# Altium project BowieGlove.PrjPcb
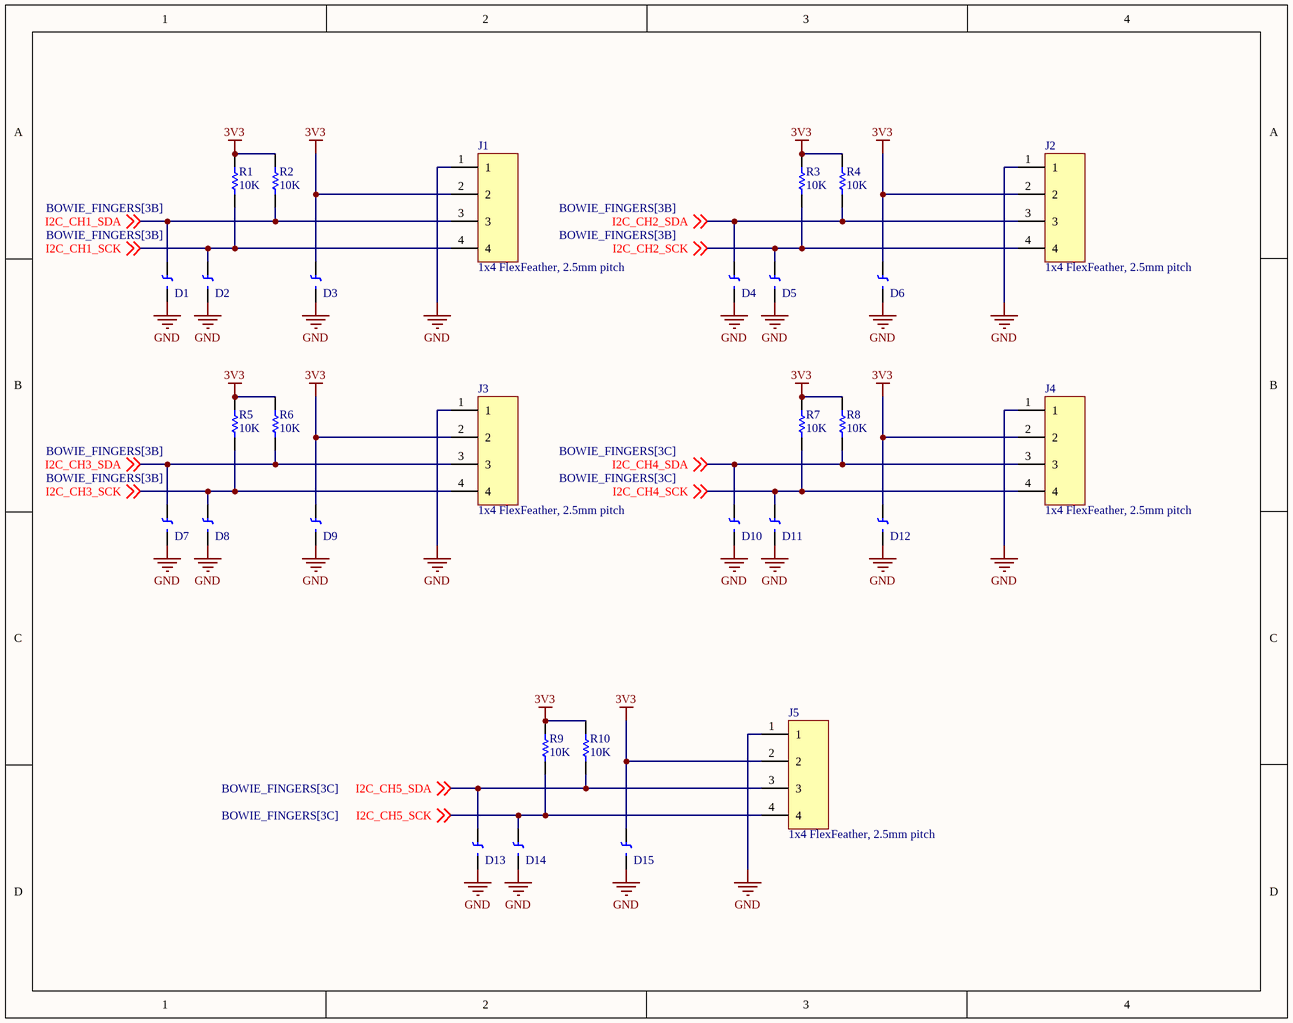
[diagram p0: BOWIE_CONNECTORS.SchDoc]
8 sheets, 103 parts. Net scope: global (net labels, ports and power ports of the same name join across sheets).
Board file: BowieGlove.PcbDoc
Sheets:
  BOWIE_CONNECTORS.SchDoc
  TETHER_CONNECTOR.SchDoc
  BOWIE_FINGERS.SchDoc
  BOWIE_MCU.SchDoc
  BOWIE_IMU.SchDoc
  USER_IO.SchDoc
  BOWIE_POWER.SchDoc
  POWER_LIPO.SchDoc

## Sheet BOWIE_CONNECTORS.SchDoc
size A; SheetNumber: 1; SheetTotal: 8

### Parts
D1  TI_ESD351DPYR  [FP-DPY0002A-MFG]  (value not drawn)
D2  TI_ESD351DPYR  [FP-DPY0002A-MFG]  (value not drawn)
D3  TI_ESD351DPYR  [FP-DPY0002A-MFG]  (value not drawn)
D4  TI_ESD351DPYR  [FP-DPY0002A-MFG]  (value not drawn)
D5  TI_ESD351DPYR  [FP-DPY0002A-MFG]  (value not drawn)
D6  TI_ESD351DPYR  [FP-DPY0002A-MFG]  (value not drawn)
D7  TI_ESD351DPYR  [FP-DPY0002A-MFG]  (value not drawn)
D8  TI_ESD351DPYR  [FP-DPY0002A-MFG]  (value not drawn)
D9  TI_ESD351DPYR  [FP-DPY0002A-MFG]  (value not drawn)
D10  TI_ESD351DPYR  [FP-DPY0002A-MFG]  (value not drawn)
D11  TI_ESD351DPYR  [FP-DPY0002A-MFG]  (value not drawn)
D12  TI_ESD351DPYR  [FP-DPY0002A-MFG]  (value not drawn)
D13  TI_ESD351DPYR  [FP-DPY0002A-MFG]  (value not drawn)
D14  TI_ESD351DPYR  [FP-DPY0002A-MFG]  (value not drawn)
D15  TI_ESD351DPYR  [FP-DPY0002A-MFG]  (value not drawn)
J1  1x4 FlexFeather, 2.5mm pitch  [FlexFeather_2.5mm_5mm_4pos]
J2  1x4 FlexFeather, 2.5mm pitch  [FlexFeather_2.5mm_5mm_4pos]
J3  1x4 FlexFeather, 2.5mm pitch  [FlexFeather_2.5mm_5mm_4pos]
J4  1x4 FlexFeather, 2.5mm pitch  [FlexFeather_2.5mm_5mm_4pos]
J5  1x4 FlexFeather, 2.5mm pitch  [FlexFeather_2.5mm_5mm_4pos]
R1  10K  [RESC1005X40X25NL05T05]
R2  10K  [RESC1005X40X25NL05T05]
R3  10K  [RESC1005X40X25NL05T05]
R4  10K  [RESC1005X40X25NL05T05]
R5  10K  [RESC1005X40X25NL05T05]
R6  10K  [RESC1005X40X25NL05T05]
R7  10K  [RESC1005X40X25NL05T05]
R8  10K  [RESC1005X40X25NL05T05]
R9  10K  [RESC1005X40X25NL05T05]
R10  10K  [RESC1005X40X25NL05T05]

### Nets
3V3: D3.2(Cathode) D6.2(Cathode) D9.2(Cathode) D12.2(Cathode) D15.2(Cathode) J1.2 J2.2 J3.2 J4.2 J5.2 R1.2 R2.2 R3.2 R4.2 R5.2 R6.2 R7.2 R8.2 R9.2 R10.2
GND: D1.1(Anode) D2.1(Anode) D3.1(Anode) D4.1(Anode) D5.1(Anode) D6.1(Anode) D7.1(Anode) D8.1(Anode) D9.1(Anode) D10.1(Anode) D11.1(Anode) D12.1(Anode) D13.1(Anode) D14.1(Anode) D15.1(Anode) J1.1 J2.1 J3.1 J4.1 J5.1
I2C_CH1_SCK: D2.2(Cathode) J1.4 R1.1 ; off-sheet I2C_CH1_SCK
I2C_CH1_SDA: D1.2(Cathode) J1.3 R2.1 ; off-sheet I2C_CH1_SDA
I2C_CH2_SCK: D5.2(Cathode) J2.4 R3.1 ; off-sheet I2C_CH2_SCK
I2C_CH2_SDA: D4.2(Cathode) J2.3 R4.1 ; off-sheet I2C_CH2_SDA
I2C_CH3_SCK: D8.2(Cathode) J3.4 R5.1 ; off-sheet I2C_CH3_SCK
I2C_CH3_SDA: D7.2(Cathode) J3.3 R6.1 ; off-sheet I2C_CH3_SDA
I2C_CH4_SCK: D11.2(Cathode) J4.4 R7.1 ; off-sheet I2C_CH4_SCK
I2C_CH4_SDA: D10.2(Cathode) J4.3 R8.1 ; off-sheet I2C_CH4_SDA
I2C_CH5_SCK: D14.2(Cathode) J5.4 R9.1 ; off-sheet I2C_CH5_SCK
I2C_CH5_SDA: D13.2(Cathode) J5.3 R10.1 ; off-sheet I2C_CH5_SDA

### Library data of the parts
D1-D15 = Diode_300mil_Zener: DIODE, TVS, UNIDIR, 3.6VRWM, 4.5VBR, 6.5VCL, 16A, 1.8PF, X1SON-2; Manufacturer: Texas Instruments; Diode Type: Unidirectional; Voltage - Breakdown (Min): 4.5V; Unidirectional Channels: 1; Capacitance @ Frequency: 1.8pF @ 1MHz; Voltage - Reverse Standoff (Typ): 3.6V; Voltage - Clamping (Max) @ Ipp: 6.5V; Power - Peak Pulse: 36W; Series: ESD351; Applications: General Purpose; Max Operating Temperature: 125°C; Current - Peak Pulse (10/1000µs): 16A; Category: TVS - Diodes; RoHS: Yes; Min Operating Temperature: -40°C; Supplier Part Number 1: 296-51109-1-ND; Mounting Type: Surface Mount; Manufacturer Part Number: ESD351DPYR; Supplier 1: Digikey; Case/Package: 2-X1SON (1x.60)
J1-J5 = FlexFeather_2.5mm_5mm_4pos: 2.5mm pitch, 5mm long, 4 pos recommended layout to connect flexpcb to e-textile with ultrasonic bonding; Internal Part Number: XXX-XXXXX-XX; System: connector; Positions: 4; Manufacturer: *; Manufacturer Part Number: *; Supplier 1: *; Supplier Part Number 1: *; ComponentLink1Description: Datasheet; ComponentLink1URL: *; Pitch: 2.5mm; Length: 5; Category: Connectors
R1-R10 = CMP-1011-00510-4: Chip Resistor, 1 KOhm, +/- 1%, 100 mW, -55 to 155 degC, 0402 (1005 Metric), RoHS, Tape and Reel; PartNumber: ERJ-2RKF1001X; Manufacturer: Basic Passives; Voltage Rating: 50 V; Case\/Package: 0402; Resistance: 1 KOhm; Power Rating: 100 mW; DatasheetVersion: 04/2015; Radiation Hardening: No; Pins: 2; Height: 0.35 mm; RoHSCompliant: true; Case Code (Imperial): 0402; ComponentLink2Description: Datasheet; ComponentLink1Description: Manufacturer URL; PackageReference: 0402; Mount: Surface Mount; Package Quantity: 10000; Tolerance: 1%; ComponentLink1URL: http://www.panasonic.com/; PackageDescription: 2-Pin Surface Mount Device, Body 1 x 0.5 mm; Mounting Technology: Surface Mount; Case Code (Metric): 1005; ComponentLink2URL: http://industrial.panasonic.com/cdbs/www-data/pdf/RDA0000/AOA0000C86.pdf; REACH SVHC: Yes; Packaging: Tape and Reel; Max Operating Temperature: 155 degC; Min Operating Temperature: -55 degC; Width: 0.5 mm; Length: 1 mm

## Sheet TETHER_CONNECTOR.SchDoc
size A; SheetNumber: 2; SheetTotal: 6
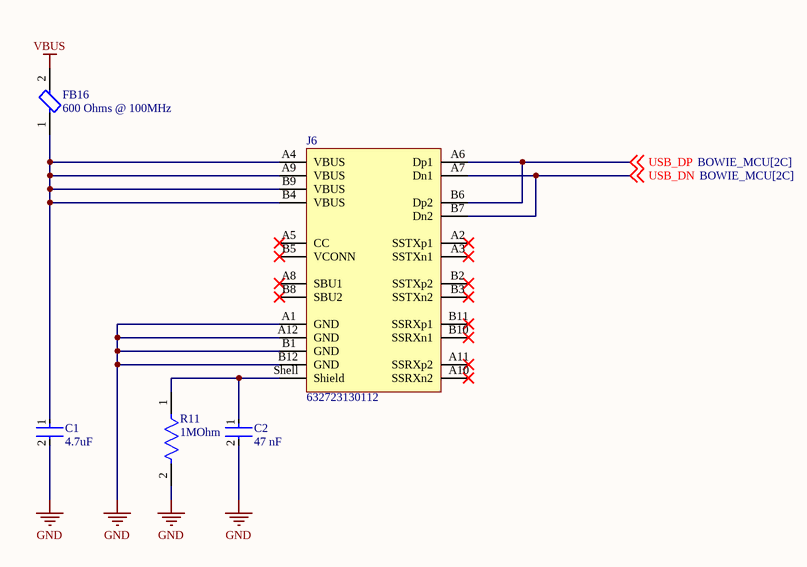
[diagram p1: TETHER_CONNECTOR.SchDoc]

### Parts
C1  4.7uF  [FP-CL828-IPC_C]
C2  47 nF  [FP-CC0402-MFG]
FB16  600 Ohms @ 100MHz  [FP-BLM15-0_05-MFG]
J6  632723130112  [632723130112]
R11  1MOhm  [FP-RMCF0402-MFG]

### Nets
GND: C1.2 C2.2 J6.A1(GND) J6.A12(GND) J6.B1(GND) J6.B12(GND) R11.2
VBUS: FB16.2
USB_DN: J6.A7(Dn1) J6.B7(Dn2) ; off-sheet USB_DN
USB_DP: J6.A6(Dp1) J6.B6(Dp2) ; off-sheet USB_DP
NetC1_1: C1.1 FB16.1 J6.A4(VBUS) J6.A9(VBUS) J6.B4(VBUS) J6.B9(VBUS)
NetC2_1: C2.1 J6.Shell(Shield) R11.1

Not connected (* = marked no-connect by the designer): J6 A2(SSTXp1)* A3(SSTXn1)* A5(CC)* A8(SBU1)* A10(SSRXn2)* A11(SSRXp2)* B2(SSTXp2)* B3(SSTXn2)* B5(VCONN)* B8(SBU2)* B10(SSRXn1)* B11(SSRXp1)*

### Library data of the parts
C1 = CMP-13271-001251-1: Cap Ceramic 4.7uF 10V X5R ±10% SMD 0402 +85°C Paper T/R; Height: 0.5mm; Mount: Surface Mount; Case Code (Metric): 1005; Case/Package: 0402; Capacitance: 4.7uF; Packaging: Tape and Reel; Dielectric: X5R; Radiation Hardening: No; Material: Ceramic; Thickness: 0.022inch; Min Operating Temperature: -55°C; Voltage Rating: 10V; Case Code (Imperial): 0402; Width: 0.02inch; Length: 1mm; Max Operating Temperature: 85°C; Lead Free: Lead Free; Tolerance: 10%; Package Quantity: 1; Depth: 0.5mm
C2 = CMP-03422-000813-1: CAP CER 0.047UF 25V X7R 0402; Manufacturer Part Number: CC0402KRX7R8BB473; Manufacturer: YAGEO; Automotive Grade: NA; Temperature Coefficient: 30ppm/°C; Material: Ceramic; Tolerance: 0.1; Temperature: -55°C to +125°C; Category: Cap; Voltage Rating: 25 V; Digikey Description: CAP CER 0.047UF 25V X7R 0402; Device Class L1: Passive Components; Device Class L3: Ceramic Capacitors; Ipc Land Pattern Name: CAPC10050X50; Value: 47 nF; Temperature Characteristic: X7R; Temperature Range High: +125°C; ComponentLink2URL: http://www.yageo.com/documents/recent/UPY-GP_NP0_16V-to-50V_16.pdf; Automotive: No; Temperature Range Low: -55°C; Package: CC0402; RoHS: TRUE; Height: 0.55mm; Device Class L2: Capacitors; Capacitance: 47 nF; Octopart: https://octopart.com/cc0402krx7r8bb473-yageo-22850998; Lead Free: Yes; Mouser Description: Multilayer Ceramic Capacitors MLCC - SMD/SMT 47nF 25V X7R 10%; Footprint Url: http://www.yageo.com/exep/pages/download/literatures/UPY-C_GEN_24.pdf; ComponentLink2Description: Datasheet
FB16 = CMP-0686-00252-4: Chip Ferrite Bead, 0402, 600Ω @ 100MHz, 0.23Ω, 25%, 900mA; Number of Circuits: 1; Impedance: 600R; DC Resistance (DCR): 230mR; Material: Steel; Length: 1mm; Package Quantity: 10000; Height: 0.5mm; Width: 0.5mm; Max DC Current: 900mA; Number of Lines: 1; Termination: SMD/SMT; Packaging: Tape and Reel; Lead Free: Lead Free; Min Operating Temperature: -55°C; Max Operating Temperature: 125°C; Max Current Rating: 900mA; Case Code (Imperial): 0402; Number of Pins: 2; Current Rating: 900mA; Test Frequency: 100MHz; Case/Package: 0402; Tolerance: 25%; Case Code (Metric): 1005
J6 = CMP-207978-000001-2: WR-COM_USB 3.1_TYPE C_HORIZONTAL; NexarPartId: 99674471; Insulation Resistance: 100MΩ; USB Standard: USB 3.1; Number of Contacts: 24; Current Rating: 5A; Voltage Rating: 20V; Gender: Receptacle; Max Operating Temperature: 85°C; Height: 3.52mm; Min Operating Temperature: -40°C; Number of Pins: 24; Contact Material: Gold, Nickel; Packaging: Tape and Reel; RoHS: Compliant
R11 = CMP-2000-06985-2: 1MΩ ±1% 0.063W 0402 Thick Film Chip Resistor AEC-Q200 compliant; Max Power Dissipation: 63mW; Resistance: 1MR; Power Rating: 62.5mW; Temperature Coefficient: 100ppm/°C; Resistor Type: Thick Film; Military Standard: Not; Packaging: Tape and Reel; Radiation Hardening: No; Construction: Rectangular; Length: 1mm; Case/Package: 0402; Width: 0.02inch; Case Code (Imperial): 0402; Lead Free: Lead Free; Number of Terminations: 2; Min Operating Temperature: -55°C; Height: 0.016inch; Tolerance: 1%; Contact Plating: Tin; Case Code (Metric): 1005; Depth: 0.5mm; Features: Automotive AEC-Q200; Max Operating Temperature: 155°C; Size Code: 0402; Mount: Surface Mount; RoHS Compliant: Yes; Series: RMCF

## Sheet BOWIE_FINGERS.SchDoc
size A; SheetNumber: 3; SheetTotal: 8
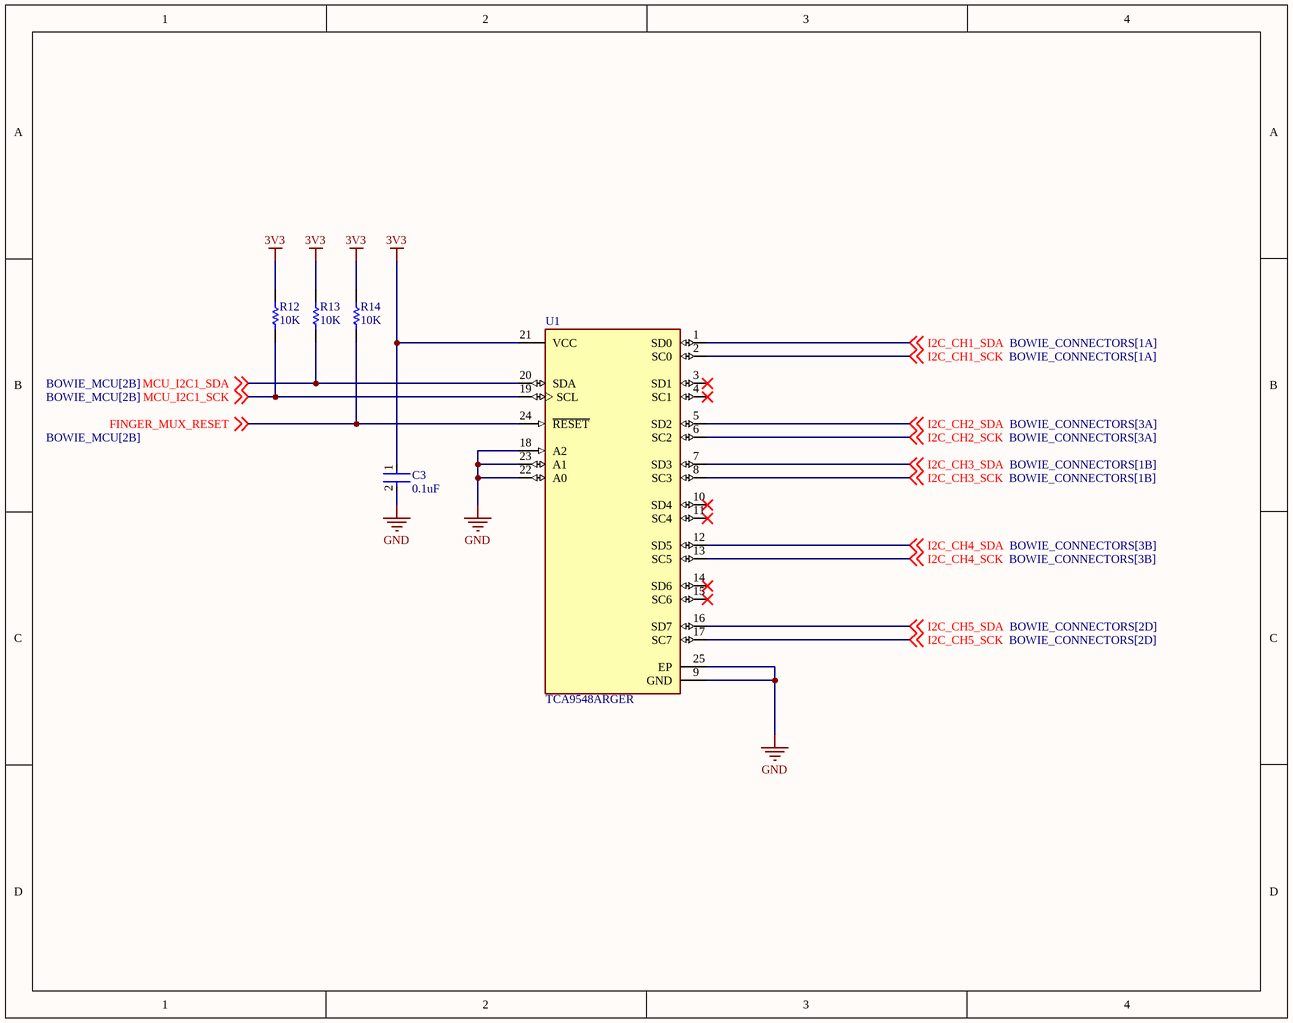
[diagram p2: BOWIE_FINGERS.SchDoc]

### Parts
C3  0.1uF  [FP-GRM15-MFG]
R12  10K  [RESC1005X40X25NL05T05]
R13  10K  [RESC1005X40X25NL05T05]
R14  10K  [RESC1005X40X25ML05T10]
U1  TCA9548ARGER  [FP-RGE0024C-MFG]

### Nets
3V3: C3.1 R12.2 R13.2 R14.2 U1.21(VCC)
GND: C3.2 U1.9(GND) U1.18(A2) U1.22(A0) U1.23(A1) U1.25(EP)
FINGER_MUX_RESET: R14.1 U1.24(~{RESET}) ; off-sheet FINGER_MUX_RESET
I2C_CH1_SCK: U1.2(SC0) ; off-sheet I2C_CH1_SCK
I2C_CH1_SDA: U1.1(SD0) ; off-sheet I2C_CH1_SDA
I2C_CH2_SCK: U1.6(SC2) ; off-sheet I2C_CH2_SCK
I2C_CH2_SDA: U1.5(SD2) ; off-sheet I2C_CH2_SDA
I2C_CH3_SCK: U1.8(SC3) ; off-sheet I2C_CH3_SCK
I2C_CH3_SDA: U1.7(SD3) ; off-sheet I2C_CH3_SDA
I2C_CH4_SCK: U1.13(SC5) ; off-sheet I2C_CH4_SCK
I2C_CH4_SDA: U1.12(SD5) ; off-sheet I2C_CH4_SDA
I2C_CH5_SCK: U1.17(SC7) ; off-sheet I2C_CH5_SCK
I2C_CH5_SDA: U1.16(SD7) ; off-sheet I2C_CH5_SDA
MCU_I2C1_SCK: R12.1 U1.19(SCL) ; off-sheet MCU_I2C1_SCK
MCU_I2C1_SDA: R13.1 U1.20(SDA) ; off-sheet MCU_I2C1_SDA

Not connected (* = marked no-connect by the designer): U1 3(SD1)* 4(SC1)* 10(SD4)* 11(SC4)* 14(SD6)* 15(SC6)*

### Library data of the parts
C3 = CMP-2100-03641-2: CAP CER 0.1UF 16V X7R 0402; Manufacturer Part Number: GRM155R71C104KA88D; Manufacturer: Murata; Standoff Height: 0mm; Tolerance: 10%; Voltage Rating: 16Vdc; Material: Ceramic; Capacitance: 0.10μF; Value: 0.10μF; RoHS: TRUE; Temperature Characteristic: X7R; Octopart: https://octopart.com/grm155r71c104ka88d-murata-196880; Digikey Description: CAP CER 0.1UF 16V X7R 0402; Device Class L3: Ceramic Capacitors; Height: 0.55mm; ComponentLink2Description: Datasheet; Temperature Range Low: -55°C; Ipc Land Pattern Name: CAPC10050X219; ComponentLink2URL: https://search.murata.co.jp/Ceramy/image/img/A01X/G101/ENG/GRM155R71H471KA01-01A.pdf; Device Class L1: Passive Components; Lead Free: yes; Category: Cap; Package: GRM15; Temperature: -55°C to +125°C; Device Class L2: Capacitors; Temperature Range High: +125°C; Mouser Description: 0402 0.1 uF 16V ±10 % Tolerance X7R SMT Multilayer Ceramic Capacitor
R12 R13 = CMP-1011-00510-4: as R1 on sheet BOWIE_CONNECTORS; DatasheetVersion: 04/2015; Radiation Hardening: No; Pins: 2; Height: 0.35 mm; RoHSCompliant: true; Case Code (Imperial): 0402; ComponentLink2Description: Datasheet; ComponentLink1Description: Manufacturer URL; PackageReference: 0402; Mount: Surface Mount; Package Quantity: 10000; Tolerance: 1%; ComponentLink1URL: http://www.panasonic.com/; PackageDescription: 2-Pin Surface Mount Device, Body 1 x 0.5 mm; Mounting Technology: Surface Mount; Case Code (Metric): 1005; ComponentLink2URL: http://industrial.panasonic.com/cdbs/www-data/pdf/RDA0000/AOA0000C86.pdf; REACH SVHC: Yes; Packaging: Tape and Reel; Max Operating Temperature: 155 degC; Min Operating Temperature: -55 degC; Width: 0.5 mm; Length: 1 mm
R14 = CMP-2002-03043-1: Part Number: CRCW040210K0FKEDHP; Manufacturer: Vishay Dale
U1 = CMP-04892-000041-1: IC I2C SW 8CH W/RESET 24VQFN; Independent Circuits: 1; Supply Type: Single; Max Supply Voltage: 5.5V; On-State Resistance: 70R; Max Supply Current: 80uA; Min Supply Voltage: 1.65V; Propagation Delay: 1ns; Mount: Surface Mount; Case/Package: VQFN; Number of Pins: 24; REACH SVHC: No SVHC; RoHS Compliant: Yes; Lead Free: Lead Free; Radiation Hardening: No; Weight: 0.001926oz; Min Operating Temperature: -40°C; Package Quantity: 3000; Packaging: Tape and Reel; Max Operating Temperature: 85°C

## Sheet BOWIE_MCU.SchDoc
size A; SheetNumber: 4; SheetTotal: 8
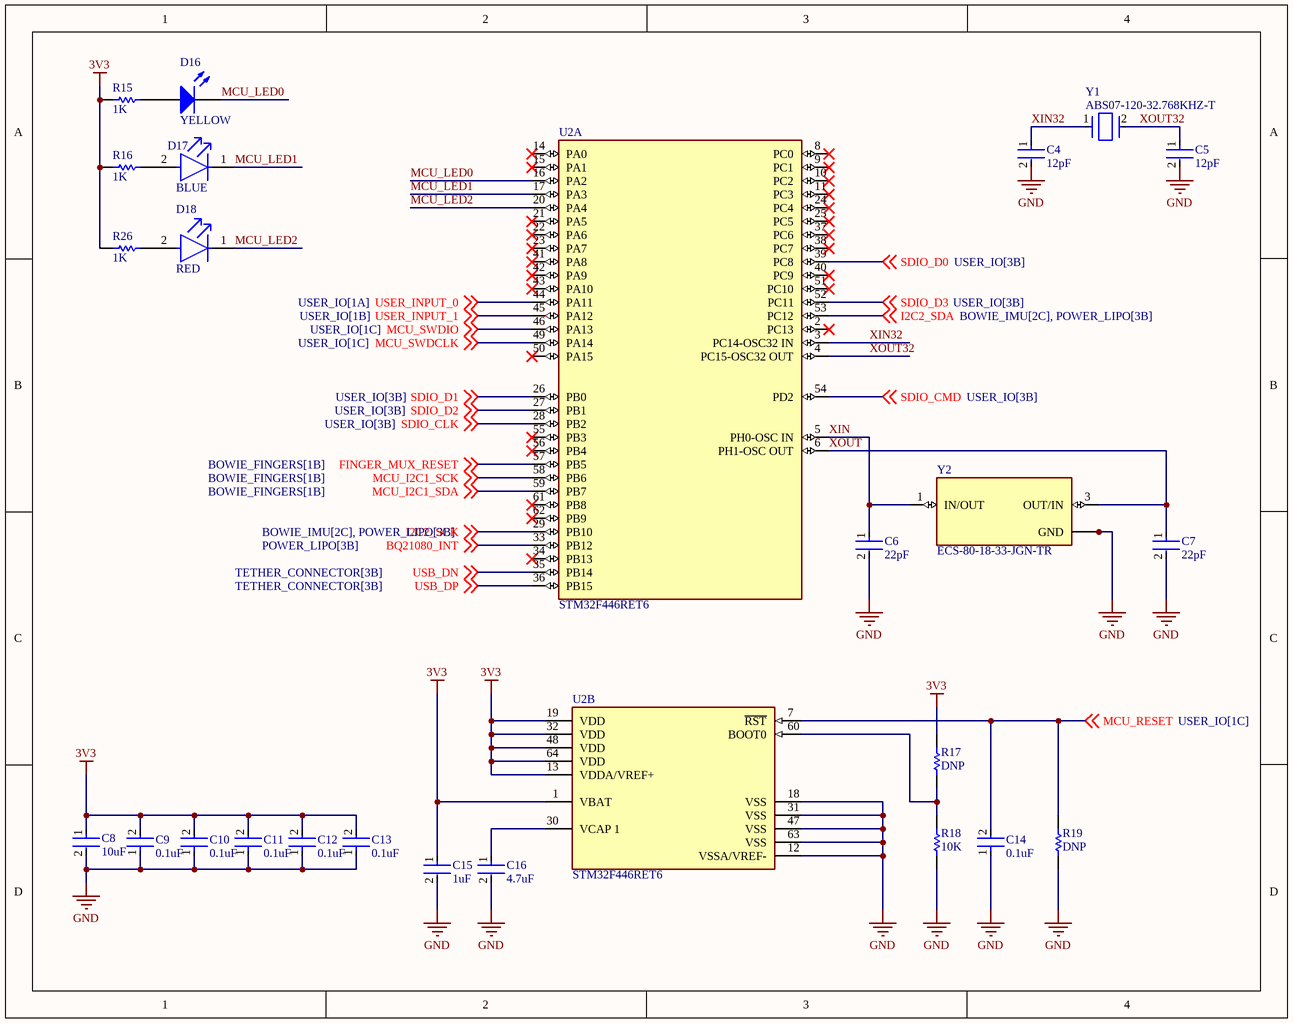
[diagram p3: BOWIE_MCU.SchDoc]

### Parts
C4  12pF  [FP-0402-L_1_0_1-W_0_5_0_1-IPC_B]
C5  12pF  [FP-0402-L_1_0_1-W_0_5_0_1-IPC_B]
C6  22pF  [FP-0402-L_1_0_1-W_0_5_0_1-MFG]
C7  22pF  [FP-0402-L_1_0_1-W_0_5_0_1-MFG]
C8  10uF  [FP-CL05A106MP5NUNC-MFG]
C9  0.1uF  [FP-CC0201-BA-MFG]
C10  0.1uF  [FP-CC0201-BA-MFG]
C11  0.1uF  [FP-CC0201-BA-MFG]
C12  0.1uF  [FP-CC0201-BA-MFG]
C13  0.1uF  [FP-CC0201-BA-MFG]
C14  0.1uF  [FP-CC0201-BA-MFG]
C15  1uF  [FP-CL511-IPC_C]
C16  4.7uF  [FP-C1005-050-0_15-MFG]
D16  YELLOW  [0603_A]
D17  BLUE  [FP-LTST-C191TBKT-MFG]
D18  RED  [FP-SML-P11UTT86-MFG]
R15  1K  [RESC1005X40X25NL05T05]
R16  1K  [RESC1005X40X25NL05T05]
R17  DNP  [RESC1005X40X25ML05T10]
R18  10K  [RESC1005X40X25ML05T10]
R19  DNP  [RESC1005X40X25NL05T10]
R26  1K  [RESC1005X40X25NL05T05]
U2  STM32F446RET6  [FP-LQFP64-5W-MFG]  (parts A,B of 2)
Y1  ABS07-120-32.768KHZ-T  [FP-ABS07-120-MFG]
Y2  ECS-80-18-33-JGN-TR  [XTAL_ECS-240-8-33-AGN-TR]

### Nets
3V3: C8.1 C9.2 C10.2 C11.2 C12.2 C13.2 C15.1 R15.1 R16.1 R17.2 R26.1 U2.1(VBAT) U2.13(VDDA/VREF+) U2.19(VDD) U2.32(VDD) U2.48(VDD) U2.64(VDD)
GND: C4.2 C5.2 C6.2 C7.2 C8.2 C9.1 C10.1 C11.1 C12.1 C13.1 C14.1 C15.2 C16.2 R18.1 R19.1 U2.12(VSSA/VREF-) U2.18(VSS) U2.31(VSS) U2.47(VSS) U2.63(VSS) Y2.2(GND) Y2.4(GND)
BQ21080_INT: U2.33(PB12) ; off-sheet BQ21080_INT
FINGER_MUX_RESET: U2.57(PB5) ; off-sheet FINGER_MUX_RESET
I2C2_SCK: U2.29(PB10) ; off-sheet I2C2_SCK
I2C2_SDA: U2.53(PC12) ; off-sheet I2C2_SDA
MCU_I2C1_SCK: U2.58(PB6) ; off-sheet MCU_I2C1_SCK
MCU_I2C1_SDA: U2.59(PB7) ; off-sheet MCU_I2C1_SDA
MCU_LED0: D16.1(K) U2.16(PA2)
MCU_LED1: D17.1(C) U2.17(PA3)
MCU_LED2: D18.1(C) U2.20(PA4)
MCU_RESET: C14.2 R19.2 U2.7(~{RST}) ; off-sheet MCU_RESET
MCU_SWDCLK: U2.49(PA14) ; off-sheet MCU_SWDCLK
MCU_SWDIO: U2.46(PA13) ; off-sheet MCU_SWDIO
SDIO_CLK: U2.28(PB2) ; off-sheet SDIO_CLK
SDIO_CMD: U2.54(PD2) ; off-sheet SDIO_CMD
SDIO_D0: U2.39(PC8) ; off-sheet SDIO_D0
SDIO_D1: U2.26(PB0) ; off-sheet SDIO_D1
SDIO_D2: U2.27(PB1) ; off-sheet SDIO_D2
SDIO_D3: U2.52(PC11) ; off-sheet SDIO_D3
USB_DN: U2.35(PB14) ; off-sheet USB_DN
USB_DP: U2.36(PB15) ; off-sheet USB_DP
USER_INPUT_0: U2.44(PA11) ; off-sheet USER_INPUT_0
USER_INPUT_1: U2.45(PA12) ; off-sheet USER_INPUT_1
XIN: C6.1 U2.5(PH0-OSC_IN) Y2.1(IN/OUT)
XIN32: C4.1 U2.3(PC14-OSC32_IN) Y1.1
XOUT: C7.1 U2.6(PH1-OSC_OUT) Y2.3(OUT/IN)
XOUT32: C5.1 U2.4(PC15-OSC32_OUT) Y1.2
NetC16_1: C16.1 U2.30(VCAP_1)
NetD16_2: D16.2(A) R15.2
NetD17_2: D17.2(A) R16.2
NetD18_2: D18.2(A) R26.2
NetR17_1: R17.1 R18.2 U2.60(BOOT0)

Not connected (* = marked no-connect by the designer): U2 2(PC13)* 8(PC0)* 9(PC1)* 10(PC2)* 11(PC3)* 14(PA0)* 15(PA1)* 21(PA5)* 22(PA6)* 23(PA7)* 24(PC4)* 25(PC5)* 34(PB13)* 37(PC6)* 38(PC7)* 40(PC9)* 41(PA8)* 42(PA9)* 43(PA10)* 50(PA15)* 51(PC10)* 55(PB3)* 56(PB4)* 61(PB8)* 62(PB9)*

### Library data of the parts
C4 C5 = CMP-1034-00771-3: General Purpose Ceramic Capacitor, 0402, 12pF, 10%, C0G, 30ppm/°C, 50V; Case/Package: 0402; Max Operating Temperature: 125°C; Tolerance: 10%; RoHS Compliant: Yes; Case Code (Imperial): 0402; Width: 0.5mm; Case Code (Metric): 1005; Radiation Hardening: No; Voltage Rating: 50V; Length: 1mm; Min Operating Temperature: -55°C; Depth: 0.5mm; Thickness: 0.022inch; Capacitance: 12pF; Packaging: Tape and Reel; Package Quantity: 10000; Mount: Surface Mount; Series: -; Construction: Flat; Dielectric: C0G; Voltage Rating (DC): 50V; Number of Pins: 2; Termination: SMD/SMT
C6 C7 = CMP-2008-02613-2: General Purpose Ceramic Capacitor, 0402, 22pF, 5%, C0G, 30ppm/°C, 50V; Temperature Coefficient: 30ppm/°C; Mount: Surface Mount; Length: 1mm; Construction: Flat; Contact Plating: Tin; REACH SVHC: No SVHC; Case/Package: 0402; Voltage: 50V; Case Code (Imperial): 0402; Thickness: 0.022inch; Radiation Hardening: No; Number of Pins: 2; Tolerance: 5%; Max Operating Temperature: 125°C; RoHS Compliant: Yes; Voltage Rating: 50V; Case Code (Metric): 1005; Package Quantity: 1; Width: 0.02inch; Termination: SMD/SMT; Lead Free: Lead Free; Height: 0.5mm; Voltage Rating (DC): 50V; Capacitance: 22pF; Min Operating Temperature: -55°C; Series: -; Depth: 0.5mm; Dielectric: C0G; Packaging: Tape and Reel
C8 = CMP-13271-000002-1: CAP CER 10UF 10V X5R 0402; Manufacturer Part Number: CL05A106MP5NUNC; Manufacturer: Samsung; Temperature Coefficient: 15%; Tolerance: 20%; Material: Ceramic; Octopart: https://octopart.com/cl05a106mp5nunc-samsung-22457395; Voltage Rating: 10V; RoHS: TRUE; Value: 10uF; Height: 0.7mm; Digikey Description: CAP CER 10UF 10V X5R 0402; Automotive: No; Package: CL05A106MP5NUNC; Device Class L1: Passive Components; Capacitance: 10uF; Temperature Range High: +85°C; ComponentLink2Description: Datasheet; Device Class L2: Capacitors; Temperature Characteristic: X5R; Temperature: -55°C to +85°C; ComponentLink2URL: http://www.samsungsem.com/kr/support/product-search/mlcc/__icsFiles/afieldfile/2019/05/10/19-CL05A106MP5NUNC.pdf; Device Class L3: Ceramic Capacitors; Category: Cap; Temperature Range Low: -55°C; Ipc Land Pattern Name: CAPC10050X50; Lead Free: Yes
C9-C14 = CMP-03422-000376-1: CAP CER 0.1UF 6.3V X5R 0201; Manufacturer: Yageo; Manufacturer Part Number: CC0201KRX5R5BB104; Tolerance: 0.1; Temperature Coefficient: 15%; Value: 100 nF; Material: Ceramic; Automotive: No; Device Class L2: Capacitors; Temperature Range High: +85°C; Capacitance: 100 nF; Temperature: -55°C to +85°C; ComponentLink2URL: http://www.yageo.com/documents/recent/UPY-GPHC_X5R_4V-to-50V_25.pdf; Category: Cap; Mouser Description: Multilayer Ceramic Capacitors MLCC - SMD/SMT 100nF 6.3V X5R 10%; Ipc Land Pattern Name: CAPC6030X30; Temperature Characteristic: X5R; Voltage Rating: 6.3 V; Lead Free: Yes; Digikey Description: CAP CER 0.1UF 6.3V X5R 0201; Device Class L1: Passive Components; Octopart: https://octopart.com/cc0201krx5r5bb104-yageo-9292636; Height: 0.33mm; Package: CC0201-BA; Footprint Url: http://www.yageo.com/exep/pages/download/literatures/UPY-C_GEN_24.pdf; ComponentLink2Description: Datasheet; Device Class L3: Ceramic Capacitors; Temperature Range Low: -55°C; RoHS: TRUE
C15 = CMP-13271-001936-1: Cap Ceramic 1uF 10V X5R ±10% SMD 0402 +85°C Paper T/R; Depth: 0.5mm; Case Code (Imperial): 0402; Material: Ceramic; Mount: Surface Mount; Thickness: 0.022inch; Dielectric: X5R; Capacitance: 1uF; Radiation Hardening: No; Case/Package: 0402; Length: 1mm; Tolerance: 10%; Max Operating Temperature: 85°C; Package Quantity: 1; Width: 0.02inch; Voltage Rating: 10V; Contact Plating: Tin; Height: 0.5mm; Min Operating Temperature: -55°C; Case Code (Metric): 1005; Packaging: Tape and Reel
C16 = CMP-2000-05997-2: CAP CER 4.7UF 10V X5R 0402; Dielectric Material: Ceramic; Tolerance: 10%; Series: C; Package Quantity: 10000; Max Operating Temperature: 85°C; Case Code (Imperial): 0402; Lead Free: Lead Free; Voltage Rating (DC): 10V; Packaging: Cut Tape; Voltage Rating: 10V; Min Operating Temperature: -55°C; Dielectric: X5R; Thickness: 0.022inch; Width: 0.02inch; Case/Package: 0402; Case Code (Metric): 1005; Capacitance: 4.7uF; Length: 0.039inch; RoHS Compliant: Yes; REACH SVHC: No SVHC; Mount: Surface Mount
D16 = CMP-1426-00005-1: SMD mono-color Chip LED, WL-SMCW, Yellow; PartNumber: 150060YS75000; Manufacturer: Wuerth Elektronik; ComponentLink1URL: http://www.we-online.com; Color: Yellow; ComponentLink2Description: Datasheet; ComponentLink2URL: http://katalog.we-online.com/led/datasheet/150060YS75000.pdf; ComponentLink1Description: Manufacturer URL; PackageReference: 0603_A
D17 = CMP-22017-000008-1: LED BLUE CLEAR CHIP SMD; Lens Color: Colorless; Dominant Wavelength: 475nm; Forward Current: 20mA; Wavelength: 468nm; Viewing Angle: 130°; Power Dissipation: 76mW; Luminous Intensity: 180mcd; Reverse Voltage: 5V; Number of Elements: 1; Lens Style: Diffused; Forward Voltage: 3.8V; Max Power Dissipation: 75mW; Case Code (Metric): 1608; Packaging: Tape and Reel; Case/Package: 0603; Depth: 1.6mm; Mount: Surface Mount; Lead Free: Lead Free; Min Operating Temperature: -20°C; Lens Transparency: Clear; Illumination Color: Blue; Height: 0.55mm; Test Current: 20mA; Case Code (Imperial): 0603; Max Operating Temperature: 80°C; Number of Pins: 2; Length: 0.8mm; Radiation Hardening: No; Package Quantity: 1; Number of LEDs: 1; Width: 0.8mm; Color: Blue
D18 = CMP-08952-000028-1: LED RED CLEAR 1006 SMD; Number of LEDs: 1; Lens Color: Colorless; Viewing Angle: 150°; Dominant Wavelength: 621nm; Luminous Intensity: 5.5mcd; Forward Voltage: 1.8V; Lens Style: Square; Test Current: 1mA; Forward Current: 20mA; Height: 0.25mm; Radiation Hardening: No; Color: Red; Case Code (Metric): 1005; Number of Pins: 2; RoHS Compliant: Yes; Max Operating Temperature: 85°C; Package Quantity: 1; Wavelength: 621nm; Lens Transparency: Clear; Packaging: Tape and Reel; Lead Free: Lead Free; Illumination Color: Red; Case/Package: 0402; Case Code (Imperial): 0402; Mount: Surface Mount; Min Operating Temperature: -40°C; Width: 0.6mm; Length: 1mm; Series: PicoLED™; REACH SVHC: No SVHC
R15 R16 R26 = CMP-1011-00510-4: as R1 on sheet BOWIE_CONNECTORS; DatasheetVersion: 04/2015; Radiation Hardening: No; Pins: 2; Height: 0.35 mm; RoHSCompliant: true; Case Code (Imperial): 0402; ComponentLink2Description: Datasheet; ComponentLink1Description: Manufacturer URL; PackageReference: 0402; Mount: Surface Mount; Package Quantity: 10000; Tolerance: 1%; ComponentLink1URL: http://www.panasonic.com/; PackageDescription: 2-Pin Surface Mount Device, Body 1 x 0.5 mm; Mounting Technology: Surface Mount; Case Code (Metric): 1005; ComponentLink2URL: http://industrial.panasonic.com/cdbs/www-data/pdf/RDA0000/AOA0000C86.pdf; REACH SVHC: Yes; Packaging: Tape and Reel; Max Operating Temperature: 155 degC; Min Operating Temperature: -55 degC; Width: 0.5 mm; Length: 1 mm
R17 R18 = CMP-2002-03043-1: as R14 on sheet BOWIE_FINGERS
R19 = CMP-1011-00001-2: Manufacturer: Yageo / Phycomp; Part Number: RC0402JR-070RL
U2 = CMP-12105-000007-1: IC MCU 32BIT 512KB FLASH 64LQFP; Manufacturer: ST; Number Of Spi Channels: 4; Ram Size: 128KBytes; Standoff Height: 0.05mm; Number Of Uart Channels: 6; Number Of Pwm Channels: 32; Max Junction Temp: +105°C; Number Of I/Os: 50; Number Of Usb Channels: 2; Frequency: 180MHz; Number Of A/D Converters: 3; Max Supply Voltage: 3.6V; Number Of Adc Channels: 16; Interface: I2C,SPI,UART,USART,CAN,USB,LIN,IrDA,I2S,Other; Memory Size: 512KBytes; Number Of Timers/Counters: 14; Min Supply Voltage: 1.7V; Core Architecture: ARM Cortex-M4; Data Bus Width: 32bits; Number Of Cores: 1; Ambient Temperature Range Low: -40°C; ComponentLink2URL: https://www.st.com/en/microcontrollers-microprocessors/stm32f446re.html; Category: IC; Height: 1.6mm; Ipc Land Pattern Name: QFP50P1200X1200X160-64; Manufacturer Part Number: STM32F446RET6; Octopart: https://octopart.com/stm32f446ret6-stmicroelectronics-52642920; Temperature Range High: +105°C; Lead Free: Yes; Mouser Description: ARM Microcontrollers - MCU High-performance and DSP with FP, ARM Cortex-M4 MCU with 512 Kbytes Flash, 180 MHz CPU, Art Accelerator, SDRAM; Digikey Description: IC MCU 32BIT 512KB FLASH 64LQFP; Ambient Temperature Range High: +85°C; Number Of I2C Channels: 4; Memory Type: FLASH; RoHS: TRUE; Automotive: No; Device Class L1: Integrated Circuits (ICs); Temperature: -40°C to +105°C; Device Class L2: Embedded Processors and Controllers; Device Class L3: Microcontrollers; Temperature Range Low: -40°C; Package: LQFP64-5W; ComponentLink2Description: Datasheet
Y1 = CMP-2000-07587-2: CRYSTAL 32.7680KHZ 6PF SMD; Frequency Tolerance: 20ppm; Series Resistance: 60kR; ESR (Equivalent Series Resistance): 55kR; Depth: 1.5mm; Width: 0.061inch; Number of Pins: 2; Max Operating Temperature: 85°C; Length: 3.2mm; Case/Package: SMD/SMT; Series: ABS07; Lead Free: Lead Free; Min Operating Temperature: -40°C; Load Capacitance: 6pF; Packaging: Tape and Reel; Height: 0.035inch; Radiation Hardening: No; Tolerance: 20ppm; Operating Frequency: 32.768 kHz; Termination: SMD/SMT; REACH SVHC: No SVHC; RoHS Compliant: Yes; Frequency: 32.768kHz; Package Quantity: 3000; Mount: Surface Mount
Y2 = ECS-80-18-33-JGN-TR: The sub miniature ECX-32 is a compact SMD Crystal. The 3.2 x 2.5 x 0.8 mm ceramic package is ideal for todayâ€™s SMD manufacturing environment.; MF: {'manufacturer': u'ECS Inc.'}; Price: None; Value: *; Package: None; Availability: Unavailable; MP: ECS-80-18-33-JGN-TR

## Sheet BOWIE_IMU.SchDoc
size A3; SheetNumber: 5; SheetTotal: 8
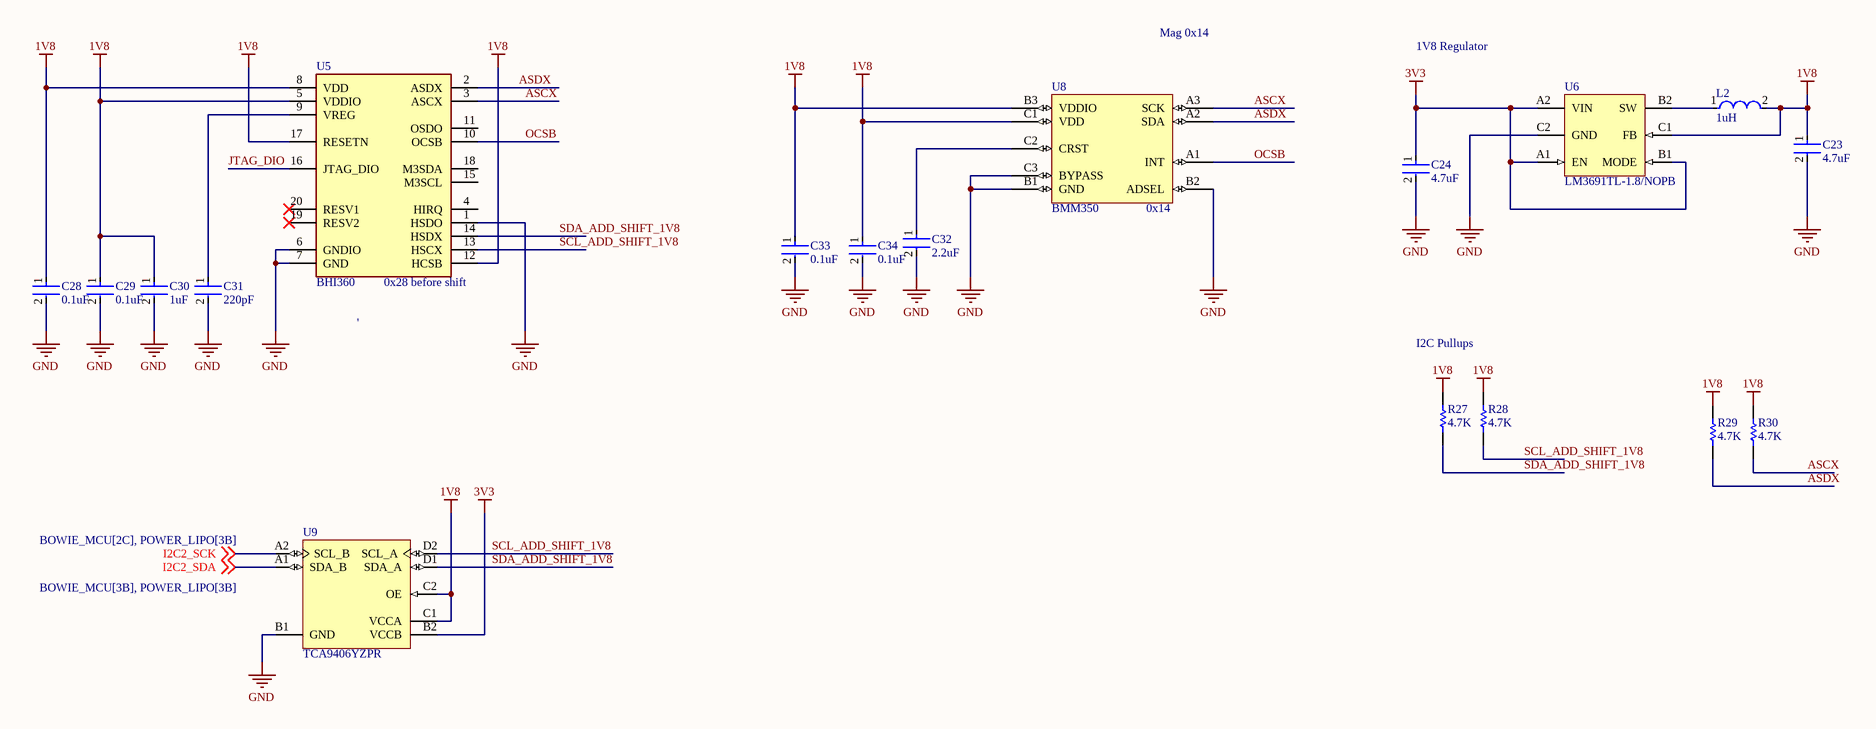
[diagram p4: BOWIE_IMU.SchDoc]

### Parts
C23  4.7uF  [FP-CL828-IPC_C]
C24  4.7uF  [FP-CL828-IPC_C]
C28  0.1uF  [FP-GRM033-0_03-IPC_C]
C29  0.1uF  [FP-GRM033-0_03-IPC_C]
C30  1uF  [FP-GRM033-0_05-e01_0_2-IPC_C]
C31  220pF  [FP-GRM033-0_03-IPC_C]
C32  2.2uF  [FP-GRM033-0_09-IPC_B]
C33  0.1uF  [FP-GRM033-0_03-IPC_C]
C34  0.1uF  [FP-GRM033-0_03-IPC_C]
L2  1uH  [FP-DFE18SAN_E0-MFG]
R27  4.7K  [RESC0603X26X15NL03T05]
R28  4.7K  [RESC0603X26X15NL03T05]
R29  4.7K  [RESC0603X26X15NL03T05]
R30  4.7K  [RESC0603X26X15NL03T05]
U5  BHI360  [BHI360]
U6  LM3691TL-1.8/NOPB  [YZR0006APAF]
U8  BMM350  [BMM350]
U9  TCA9406YZPR  [YZP0008ADAD]

### Nets
1V8: C23.1 C28.1 C29.1 C30.1 C33.1 C34.1 L2.2 R27.2 R28.2 R29.2 R30.2 U5.5(VDDIO) U5.8(VDD) U5.12(HCSB) U5.17(RESETN) U6.C1(FB) U8.B3(VDDIO) U8.C1(VDD) U9.C1(VCCA) U9.C2(OE)
3V3: C24.1 U6.A1(EN) U6.A2(VIN) U6.B1(MODE) U9.B2(VCCB)
GND: C23.2 C24.2 C28.2 C29.2 C30.2 C31.2 C32.2 C33.2 C34.2 U5.1(HSDO) U5.6(GNDIO) U5.7(GND) U6.C2(GND) U8.B1(GND) U8.B2(ADSEL) U8.C3(BYPASS) U9.B1(GND)
ASCX: R30.1 U5.3(ASCX) U8.A3(SCK)
ASDX: R29.1 U5.2(ASDX) U8.A2(SDA)
I2C2_SCK: U9.A2(SCL_B) ; off-sheet I2C2_SCK
I2C2_SDA: U9.A1(SDA_B) ; off-sheet I2C2_SDA
JTAG_DIO: U5.16(JTAG_DIO)
OCSB: U5.10(OCSB) U8.A1(INT)
SCL_ADD_SHIFT_1V8: R28.1 U5.13(HSCX) U9.D2(SCL_A)
SDA_ADD_SHIFT_1V8: R27.1 U5.14(HSDX) U9.D1(SDA_A)
NetC31_1: C31.1 U5.9(VREG)
NetC32_1: C32.1 U8.C2(CRST)
NetL2_1: L2.1 U6.B2(SW)

Not connected (* = marked no-connect by the designer): U5 4(HIRQ) 11(OSDO) 15(M3SCL) 18(M3SDA) 19(RESV2)* 20(RESV1)*

### Notes on the sheet
- Mag 0x14
- 1V8 Regulator
- (near U8) 0x14
- '
- (near U5) 0x28 before shift
- I2C Pullups

### Library data of the parts
C23 C24 = CMP-13271-001251-1: as C1 on sheet TETHER_CONNECTOR; Height: 0.5mm; Mount: Surface Mount; Case Code (Metric): 1005; Case/Package: 0402; Capacitance: 4.7uF; Packaging: Tape and Reel; Dielectric: X5R; Radiation Hardening: No; Material: Ceramic; Thickness: 0.022inch; Min Operating Temperature: -55°C; Voltage Rating: 10V; Case Code (Imperial): 0402; Width: 0.02inch; Length: 1mm; Max Operating Temperature: 85°C; Lead Free: Lead Free; Tolerance: 10%; Package Quantity: 1; Depth: 0.5mm
C28 C29 C33 C34 = CMP-2010-01264-2: Chip Multilayer Ceramic Capacitors for General Purpose, 0201, 0.10uF, X5R, 15%, 10%, 10V; Capacitance: 100nF; Mount: Surface Mount; Dielectric: X5R; Width: 0.012inch; Tolerance: 10%; Radiation Hardening: No; Voltage Rating: 10V; REACH SVHC: No SVHC; Height: 0.3mm; Max Operating Temperature: 85°C; Voltage Rating (DC): 10V; Thickness: 0.013inch; Termination: SMD/SMT; Lead Free: Lead Free; Package Quantity: 1; Case/Package: 0201; Min Operating Temperature: -55°C; Weight: 6E-06oz; Length: 0.6mm; Case Code (Imperial): 0201; Depth: 0.3mm; Voltage: 10V; Packaging: Tape and Reel; Case Code (Metric): 0603
C30 = CMP-06035-049957-1: Chip Multilayer Ceramic Capacitors for General Purpose, 0201, 1.0uF, X5R, 15%, 20%, 4V; Case Code (Metric): 0603; Height: 0.3mm; Packaging: Tape and Reel; Case/Package: 0201; Voltage Rating: 4V; Case Code (Imperial): 0201; Min Operating Temperature: -55°C; Length: 0.024inch; Package Quantity: 15000; Voltage Rating (DC): 4V; Dielectric: X5R; Thickness: 0.014inch; Termination: SMD/SMT; Tolerance: 20%; Max Operating Temperature: 85°C; Mount: Surface Mount; Width: 0.012inch; Capacitance: 1uF; Weight: 1.2E-05oz
C31 = CMP-2010-01692-2: Chip Multilayer Ceramic Capacitors for General Purpose, 0201, 220pF, X7R, 15%, 10%, 16V; Radiation Hardening: No; Tolerance: 10%; Depth: 0.3mm; Height: 0.3mm; Lead Free: Lead Free; Voltage Rating (DC): 16V; Case Code (Metric): 0603; Capacitance: 220pF; Termination: SMD/SMT; Mount: Surface Mount; Width: 0.012inch; Case Code (Imperial): 0201; Min Operating Temperature: -55°C; Thickness: 0.013inch; Case/Package: 0201; Voltage Rating: 16V; Dielectric: X7R; Length: 0.6mm; Max Operating Temperature: 125°C; Package Quantity: 15000; Packaging: Tape and Reel
C32 = CMP-06035-032992-1: Chip Multilayer Ceramic Capacitors for General Purpose, 0201, 2.2uF, X5R, 15%, 10%, 10V; Min Operating Temperature: -55°C; Case/Package: 0201; Capacitance: 2.2uF; Dielectric: X5R; Case Code (Metric): 0603; Width: 0.012inch; Voltage Rating: 10V; Length: 0.024inch; Packaging: Tape and Reel; Case Code (Imperial): 0201; Mount: Surface Mount; Tolerance: 10%; Voltage Rating (DC): 10V; Max Operating Temperature: 85°C; Thickness: 0.015inch
L2 = CMP-06042-016331-1: FIXED IND 1UH 1.6A 144 MOHM SMD; Saturation Current: 2A; DC Resistance (DCR): 144mR; Shielding: Shielded; Core Material: Metal; Tolerance: 20%; Test Frequency: 1MHz; Mount: Surface Mount; Min Operating Temperature: -40°C; Current Rating: 1.6A; Case Code (Imperial): 0603; Inductance: 1uH; RoHS Compliant: Yes; Max Operating Temperature: 85°C; Case/Package: 0603; Packaging: Cut Tape; Case Code (Metric): 1608
R27-R30 = CMP-2004-02966-1: Part Number: ERJ-1GEF4701C; Manufacturer: Panasonic
U5 = BHI360: IMUs - Inertial Measurement Units Programmable smart sensor combining accelerometer, gyroscope and fusion software; Manufacturer_Name: BOSCH; Geometry.Height: 1mm; Mouser Part Number: 262-BHI360; Mouser Price/Stock: https://www.mouser.co.uk/ProductDetail/Bosch-Sensortec/BHI360?qs=ulEaXIWI0c93cz3Dqv%252BGgg%3D%3D; Manufacturer_Part_Number: BHI360; Datasheet Link: https://www.bosch-sensortec.com/media/boschsensortec/downloads/datasheets/bst-bhi360-ds000.pdf
U6 = CMP-0063-00271-3: High Accuracy, Miniature 1A, Step-Down DC-DC Converter for Portable Applications, 6-pin Micro SMD, Pb-Free; Manufacturer: Texas Instruments; PackageTopMarking: XV*I Z; CompType: MiscPower; High-Reliability: Y; PinCount: 6; PartNumber: LM3691TL-1.8/NOPB; PackageDescription: Thin Micro SMD, 6 Bump (Large), 0.5mm Pitch; RoHS: Y; PackageReference: YZR0006APAF; ComponentLink1URL: http://www.ti.com/general/docs/lit/getliterature.tsp?genericPartNumber=LM3691&fileType=pdf; Code_JEDEC: MO-211-DB; ComponentLink1Description: Datasheet URL; PowerWise: Y
U9 = CMP-0314-00005-2: TCA9406 Dual Bidirectional 1-MHz I2C-BUS and SMBus Voltage Level-Translator, 1.65 to 3.6 V, -40 to 85 degC, 8-pin DSBGA (YZP), Green (RoHS & no Sb/Br); Manufacturer: Texas Instruments; SubFamily: I2C Special Function; Push-Pull I/O Type: Yes; Max Frequency(kHz): 1000; No. of Outputs: 2; Function: I2C Voltage Level Translator; VCC(Min)(V): -0.5; VCC(Max)(V): 4.6; Rating: Catalog; PartNumber: TCA9406YZPR; PackageReference: YZP0008ADAD; Eco-Plan: Green (RoHS & no Sb/Br); ComponentLink1Description: Datasheet; PackageDescription: 8-Ball Die-Size Ball Grid Array, 1.9 x 0.9 mm Body, 0.5 mm Pitch, Pb-Free; On-Chip Power-on-Reset: No; DatasheetVersion: SCPS221; Mounting Technology: Surface Mount; PackageVersion: revI, Feb-2012; Vcc range(V): 1.65 to 3.6; ComponentLink1URL: http://www.ti.com/general/docs/lit/getliterature.tsp?genericPartNumber=TCA9406&fileType=pdf; 5V Tolerant I/O: Yes; ComponentLink2Description: Package Specification; Enable Pin: Yes; ComponentLink2URL: http://www.ti.com/litv/pdf/msoi002j; Open Drain I/O Type: Yes

## Sheet USER_IO.SchDoc
size A; SheetNumber: 5; SheetTotal: 7
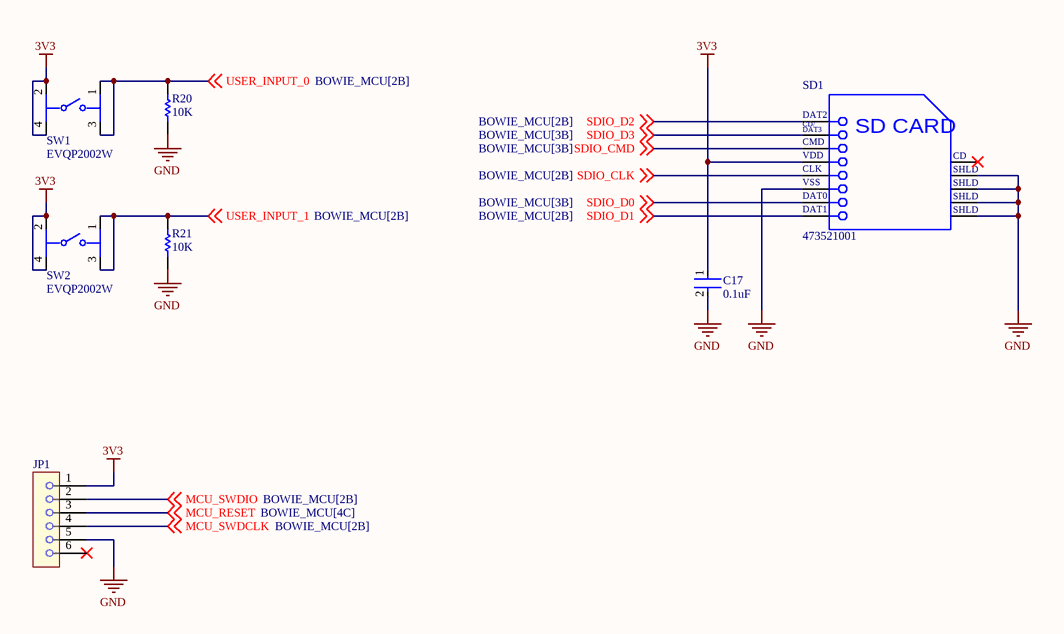
[diagram p5: USER_IO.SchDoc]

### Parts
C17  0.1uF  [FP-GRM15-MFG]
JP1  TC2030-6-NL-FOOTPRINT  [TAG_TC2030_NL_6]  (value not drawn)  (no BOM)
R20  10K  [RESC1005X40X25ML05T10]
R21  10K  [RESC1005X40X25ML05T10]
SD1  473521001  [MOLX-473521001_V]
SW1  EVQP2002W  [FP-EVQP2002W-MFG]
SW2  EVQP2002W  [FP-EVQP2002W-MFG]

### Nets
3V3: C17.1 JP1.1 SD1.4(VDD) SW1.2 SW1.4 SW2.2 SW2.4
GND: C17.2 JP1.5 R20.1 R21.1 SD1.6(VSS) SD1.10(SHLD) SD1.11(SHLD) SD1.12(SHLD) SD1.13(SHLD)
MCU_RESET: JP1.3 ; off-sheet MCU_RESET
MCU_SWDCLK: JP1.4 ; off-sheet MCU_SWDCLK
MCU_SWDIO: JP1.2 ; off-sheet MCU_SWDIO
SDIO_CLK: SD1.5(CLK) ; off-sheet SDIO_CLK
SDIO_CMD: SD1.3(CMD) ; off-sheet SDIO_CMD
SDIO_D0: SD1.7(DAT0) ; off-sheet SDIO_D0
SDIO_D1: SD1.8(DAT1) ; off-sheet SDIO_D1
SDIO_D2: SD1.1(DAT2) ; off-sheet SDIO_D2
SDIO_D3: SD1.2(CD/DAT3) ; off-sheet SDIO_D3
USER_INPUT_0: R20.2 SW1.1 SW1.3 ; off-sheet USER_INPUT_0
USER_INPUT_1: R21.2 SW2.1 SW2.3 ; off-sheet USER_INPUT_1

Not connected (* = marked no-connect by the designer): JP1 6*; SD1 9(CD)*

### Notes on the sheet
- (in symbol CMP-2000-05848-1) CD/; DAT3; SD CARD

### Library data of the parts
C17 = CMP-2100-03641-2: as C3 on sheet BOWIE_FINGERS; RoHS: TRUE; Temperature Characteristic: X7R; Octopart: https://octopart.com/grm155r71c104ka88d-murata-196880; Digikey Description: CAP CER 0.1UF 16V X7R 0402; Device Class L3: Ceramic Capacitors; Height: 0.55mm; ComponentLink2Description: Datasheet; Temperature Range Low: -55°C; Ipc Land Pattern Name: CAPC10050X219; ComponentLink2URL: https://search.murata.co.jp/Ceramy/image/img/A01X/G101/ENG/GRM155R71H471KA01-01A.pdf; Device Class L1: Passive Components; Lead Free: yes; Category: Cap; Package: GRM15; Temperature: -55°C to +125°C; Device Class L2: Capacitors; Temperature Range High: +125°C; Mouser Description: 0402 0.1 uF 16V ±10 % Tolerance X7R SMT Multilayer Ceramic Capacitor
JP1 = TC2030-6-NL-FOOTPRINT: CONN, FP, 2X3, .05, DEBUG, SMT; Manufacturer: NO PART; Part Number: FOOTPRINT ONLY
R20 R21 = CMP-2002-03043-1: as R14 on sheet BOWIE_FINGERS
SD1 = CMP-2000-05848-1: MicroSD(TM), Pitch 1.1 mm, 8 Position, Height 1.88 mm, -20 to 85 degC, RoHS, Tape and Reel; Manufacturer: Molex; Datasheet Version: Rev. G, 01/2012; Datasheet URL: http://www.molex.com/pdm_docs/sd/473521001_sd.pdf; Package Reference: 473521001; Manufacturer URL: http://www.molex.com/; Mounting Technology: SurfaceMount; Package Description: MicroSD(TM), Pitch 1.1 mm, 8 Position, Height 1.88 mm
SW1 SW2 = CMP-05618-000142-1: SWITCH TACTILE SPST-NO 0.02A 15V; Throw Configuration: SPST; Electrical Life: 1000000Cycles; Contact Current Rating: 20mA; Actuator Color: Natural; Contact Resistance: 100mR; Switch Travel: 0.25mm; Illumination Type: Non-Illuminated; Operating Force: 1N; Actuator Length: 0.85mm; Switch Function: Off-Mom; RoHS Compliant: Yes; Height: 2.5mm; Termination: J-Bend; Size: 3.5mm; Min Operating Temperature: -40°C; Contact Plating: Silver; Orientation: Straight; Package Quantity: 1; Voltage Rating (DC): 15V; Mount: Surface Mount; Mechanical Life: 1000000Cycles; Packaging: Tape and Reel; Max Current Rating: 20mA; Current Rating: 20mA; Length: 3.5mm; Radiation Hardening: No; Max Operating Temperature: 85°C; Lead Free: Lead Free; REACH SVHC: No SVHC; Depth: 5.5mm; Max Voltage Rating (DC): 15V; Series: EVQP2

## Sheet BOWIE_POWER.SchDoc
size A; SheetNumber: 6; SheetTotal: 7
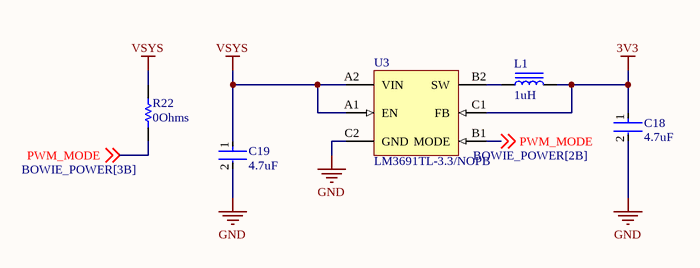
[diagram p6: BOWIE_POWER.SchDoc]

### Parts
C18  4.7uF  [FP-CL828-IPC_C]
C19  4.7uF  [FP-CL828-IPC_C]
L1  1uH  [IND 0603_1608 RF WW]
R22  0Ohms  [RESC1005X40X25ML05T10]
U3  LM3691TL-3.3/NOPB  [YZR0006APAF]

### Nets
3V3: C18.1 L1.2 U3.C1(FB)
GND: C18.2 C19.2 U3.C2(GND)
VSYS: C19.1 R22.1 U3.A1(EN) U3.A2(VIN)
PWM_MODE: R22.2 U3.B1(MODE) ; off-sheet PWM_MODE
NetL1_1: L1.1 U3.B2(SW)

### Library data of the parts
C18 C19 = CMP-13271-001251-1: as C1 on sheet TETHER_CONNECTOR; Height: 0.5mm; Mount: Surface Mount; Case Code (Metric): 1005; Case/Package: 0402; Capacitance: 4.7uF; Packaging: Tape and Reel; Dielectric: X5R; Radiation Hardening: No; Material: Ceramic; Thickness: 0.022inch; Min Operating Temperature: -55°C; Voltage Rating: 10V; Case Code (Imperial): 0402; Width: 0.02inch; Length: 1mm; Max Operating Temperature: 85°C; Lead Free: Lead Free; Tolerance: 10%; Package Quantity: 1; Depth: 0.5mm
L1 = MCHK1608T1R0MKN: SMT Inductor; Manufacturer: Taiyo Yuden; Part Number: MCHK1608T1R0MKN; Value: 1uH
R22 = CMP-2002-03043-1: as R14 on sheet BOWIE_FINGERS
U3 = CMP-0063-01484-2: High Accuracy, Miniature 1A, Step-Down DC-DC Converter for Portable Applications, 6-pin Micro SMD, 250 Reel; Manufacturer: Texas Instruments; PackageTopMarking: XV*I T; PowerWise: N; CompType: MiscPower; High-Reliability: Y; RoHS: Y; PackageDescription: Thin Micro SMD, 6 Bump (Large), 0.5mm Pitch; PinCount: 6; ComponentLink1URL: http://www.ti.com/general/docs/lit/getliterature.tsp?genericPartNumber=LM3691&fileType=pdf; PackageReference: YZR0006APAF; PartNumber: LM3691TL-3.3/NOPB; ComponentLink1Description: Datasheet URL; Code_JEDEC: MO-211-DB

## Sheet POWER_LIPO.SchDoc
size A; SheetNumber: 7; SheetTotal: 7
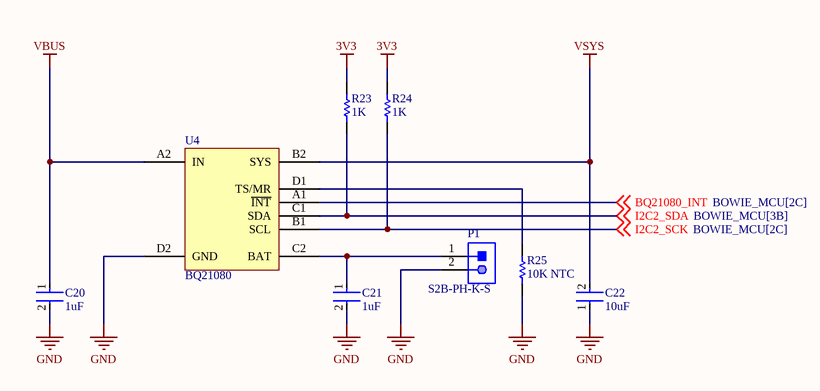
[diagram p7: POWER_LIPO.SchDoc]

### Parts
C20  1uF  [FP-0603-L_1_6_0_15-W_0_8-IPC_C]
C21  1uF  [FP-0603-L_1_6_0_15-W_0_8-IPC_C]
C22  10uF  [FP-C1608-080-0_1-MFG]
P1  S2B-PH-K-S  [JST-S2B-PH-K-S_V]
R23  1K  [RESC1005X40X25NL05T05]
R24  1K  [RESC1005X40X25NL05T05]
R25  10K NTC  [RESC1005X40X25NL05T05]
U4  BQ21080  [BQ21080_bga]

### Nets
3V3: R23.2 R24.2
GND: C20.2 C21.2 C22.1 P1.2 R25.1 U4.D2(GND)
VBUS: C20.1 U4.A2(IN)
VSYS: C22.2 U4.B2(SYS)
BQ21080_INT: U4.A1(~{INT}) ; off-sheet BQ21080_INT
I2C2_SCK: R24.1 U4.B1(SCL) ; off-sheet I2C2_SCK
I2C2_SDA: R23.1 U4.C1(SDA) ; off-sheet I2C2_SDA
NetC21_1: C21.1 P1.1 U4.C2(BAT)
NetR25_2: R25.2 U4.D1(TS/MR)

### Library data of the parts
C20 C21 = CMP-2000-07531-4: Ceramic Capacitor General Use 1uF ±10% 50V X7R 0603; Series: M; Width: 0.031inch; Mount: Surface Mount; Radiation Hardening: No; Voltage Rating (DC): 50V; Packaging: Tape and Reel; Termination: SMD/SMT; Depth: 0.8mm; Case Code (Metric): 1608; Case Code (Imperial): 0603; Height: 0.8mm; Voltage Rating: 50V; Package Quantity: 1; Halogen Free: Halogen Free; Dielectric: X7R; Min Operating Temperature: -55°C; Length: 1.6mm; Construction: Flat; Tolerance: 10%; Thickness: 0.037inch; Max Operating Temperature: 125°C; Case/Package: 0603; Capacitance: 1uF; RoHS Compliant: Yes
C22 = CMP-2000-04979-3: Multilayer Ceramic Capacitors 10μF ±10% 10V X5R SMD 0603; Dielectric Material: Ceramic; Construction: Flat; Height: 0.8mm; Thickness: 0.035inch; Case Code (Metric): 1608; Radiation Hardening: No; Number of Pins: 2; Voltage Rating (DC): 10V; Depth: 0.8mm; Voltage: 10V; RoHS Compliant: Yes; Voltage Rating: 10V; Package Quantity: 1; Resistor Type: Ceramic; Termination: SMD/SMT; Lead Free: Lead Free; REACH SVHC: No SVHC; Tolerance: 10%; Mount: Surface Mount; Series: C; Packaging: Tape and Reel; Width: 0.8mm; Dielectric: X5R; Weight: 7.1E-05oz; Length: 1.6mm; Max Operating Temperature: 85°C; Case Code (Imperial): 0603; Case/Package: 0603; Min Operating Temperature: -55°C; Capacitance: 10uF
P1 = CMP-1755-00004-1: Male Header, Pitch 2 mm, 1 x 2 Position, Height 4.8 mm, Tail Length 3.4 mm, -25 to 85 degC, RoHS, Bulk; Case\Package: Radial; Tolerance: 20%; Capacitance: 10 uF; Voltage Rating (DC): 50 V; Packaging: Bulk; ComponentLink1URL: http://www.jst-mfg.com/product/pdf/eng/ePH.pdf; Radiation Hardening: No; Height: 11 mm; Package Quantity: 200; PackageDescription: Male Header, Pitch 2 mm, 1 x 2 Position, Height 4.8 mm, Tail Length 3.4 mm; PackageReference: S2B-PH-K-S; Diameter: 5 mm; Pins: 2; Mount: Through Hole; Max Operating Temperature: 85 degC; Min Operating Temperature: -40 degC; ComponentLink1Description: Datasheet; DatasheetVersion: Dec-12; Length: 11 mm; Lead Pitch: 2 mm; REACH SVHC: No SVHC; Voltage Rating: 50 V; RoHSCompliant: true
R23 R24 = CMP-1011-00510-4: as R1 on sheet BOWIE_CONNECTORS; DatasheetVersion: 04/2015; Radiation Hardening: No; Pins: 2; Height: 0.35 mm; RoHSCompliant: true; Case Code (Imperial): 0402; ComponentLink2Description: Datasheet; ComponentLink1Description: Manufacturer URL; PackageReference: 0402; Mount: Surface Mount; Package Quantity: 10000; Tolerance: 1%; ComponentLink1URL: http://www.panasonic.com/; PackageDescription: 2-Pin Surface Mount Device, Body 1 x 0.5 mm; Mounting Technology: Surface Mount; Case Code (Metric): 1005; ComponentLink2URL: http://industrial.panasonic.com/cdbs/www-data/pdf/RDA0000/AOA0000C86.pdf; REACH SVHC: Yes; Packaging: Tape and Reel; Max Operating Temperature: 155 degC; Min Operating Temperature: -55 degC; Width: 0.5 mm; Length: 1 mm
R25 = CMP-2002-01183-1: Part Number: ERT-J0ER103J; Manufacturer: Panasonic

## Nets that join several sheets
3V3: BOWIE_CONNECTORS (20 pins), BOWIE_FINGERS (5 pins), BOWIE_MCU (17 pins), BOWIE_IMU (5 pins), USER_IO (7 pins), BOWIE_POWER (C18.1 L1.2 U3.C1), POWER_LIPO (R23.2 R24.2)
GND: BOWIE_CONNECTORS (20 pins), TETHER_CONNECTOR (7 pins), BOWIE_FINGERS (6 pins), BOWIE_MCU (22 pins), BOWIE_IMU (17 pins), USER_IO (9 pins), BOWIE_POWER (C18.2 C19.2 U3.C2), POWER_LIPO (6 pins)
VBUS: TETHER_CONNECTOR (FB16.2), POWER_LIPO (C20.1 U4.A2)
VSYS: BOWIE_POWER (C19.1 R22.1 U3.A1 U3.A2), POWER_LIPO (C22.2 U4.B2)
BQ21080_INT: BOWIE_MCU (U2.33), POWER_LIPO (U4.A1)
FINGER_MUX_RESET: BOWIE_FINGERS (R14.1 U1.24), BOWIE_MCU (U2.57)
I2C2_SCK: BOWIE_MCU (U2.29), BOWIE_IMU (U9.A2), POWER_LIPO (R24.1 U4.B1)
I2C2_SDA: BOWIE_MCU (U2.53), BOWIE_IMU (U9.A1), POWER_LIPO (R23.1 U4.C1)
I2C_CH1_SCK: BOWIE_CONNECTORS (D2.2 J1.4 R1.1), BOWIE_FINGERS (U1.2)
I2C_CH1_SDA: BOWIE_CONNECTORS (D1.2 J1.3 R2.1), BOWIE_FINGERS (U1.1)
I2C_CH2_SCK: BOWIE_CONNECTORS (D5.2 J2.4 R3.1), BOWIE_FINGERS (U1.6)
I2C_CH2_SDA: BOWIE_CONNECTORS (D4.2 J2.3 R4.1), BOWIE_FINGERS (U1.5)
I2C_CH3_SCK: BOWIE_CONNECTORS (D8.2 J3.4 R5.1), BOWIE_FINGERS (U1.8)
I2C_CH3_SDA: BOWIE_CONNECTORS (D7.2 J3.3 R6.1), BOWIE_FINGERS (U1.7)
I2C_CH4_SCK: BOWIE_CONNECTORS (D11.2 J4.4 R7.1), BOWIE_FINGERS (U1.13)
I2C_CH4_SDA: BOWIE_CONNECTORS (D10.2 J4.3 R8.1), BOWIE_FINGERS (U1.12)
I2C_CH5_SCK: BOWIE_CONNECTORS (D14.2 J5.4 R9.1), BOWIE_FINGERS (U1.17)
I2C_CH5_SDA: BOWIE_CONNECTORS (D13.2 J5.3 R10.1), BOWIE_FINGERS (U1.16)
MCU_I2C1_SCK: BOWIE_FINGERS (R12.1 U1.19), BOWIE_MCU (U2.58)
MCU_I2C1_SDA: BOWIE_FINGERS (R13.1 U1.20), BOWIE_MCU (U2.59)
MCU_RESET: BOWIE_MCU (C14.2 R19.2 U2.7), USER_IO (JP1.3)
MCU_SWDCLK: BOWIE_MCU (U2.49), USER_IO (JP1.4)
MCU_SWDIO: BOWIE_MCU (U2.46), USER_IO (JP1.2)
SDIO_CLK: BOWIE_MCU (U2.28), USER_IO (SD1.5)
SDIO_CMD: BOWIE_MCU (U2.54), USER_IO (SD1.3)
SDIO_D0: BOWIE_MCU (U2.39), USER_IO (SD1.7)
SDIO_D1: BOWIE_MCU (U2.26), USER_IO (SD1.8)
SDIO_D2: BOWIE_MCU (U2.27), USER_IO (SD1.1)
SDIO_D3: BOWIE_MCU (U2.52), USER_IO (SD1.2)
USB_DN: TETHER_CONNECTOR (J6.A7 J6.B7), BOWIE_MCU (U2.35)
USB_DP: TETHER_CONNECTOR (J6.A6 J6.B6), BOWIE_MCU (U2.36)
USER_INPUT_0: BOWIE_MCU (U2.44), USER_IO (R20.2 SW1.1 SW1.3)
USER_INPUT_1: BOWIE_MCU (U2.45), USER_IO (R21.2 SW2.1 SW2.3)

## Assembly variants
Default: not fitted R17